# Altium schematic sheet Sheet.SchDoc
size A3
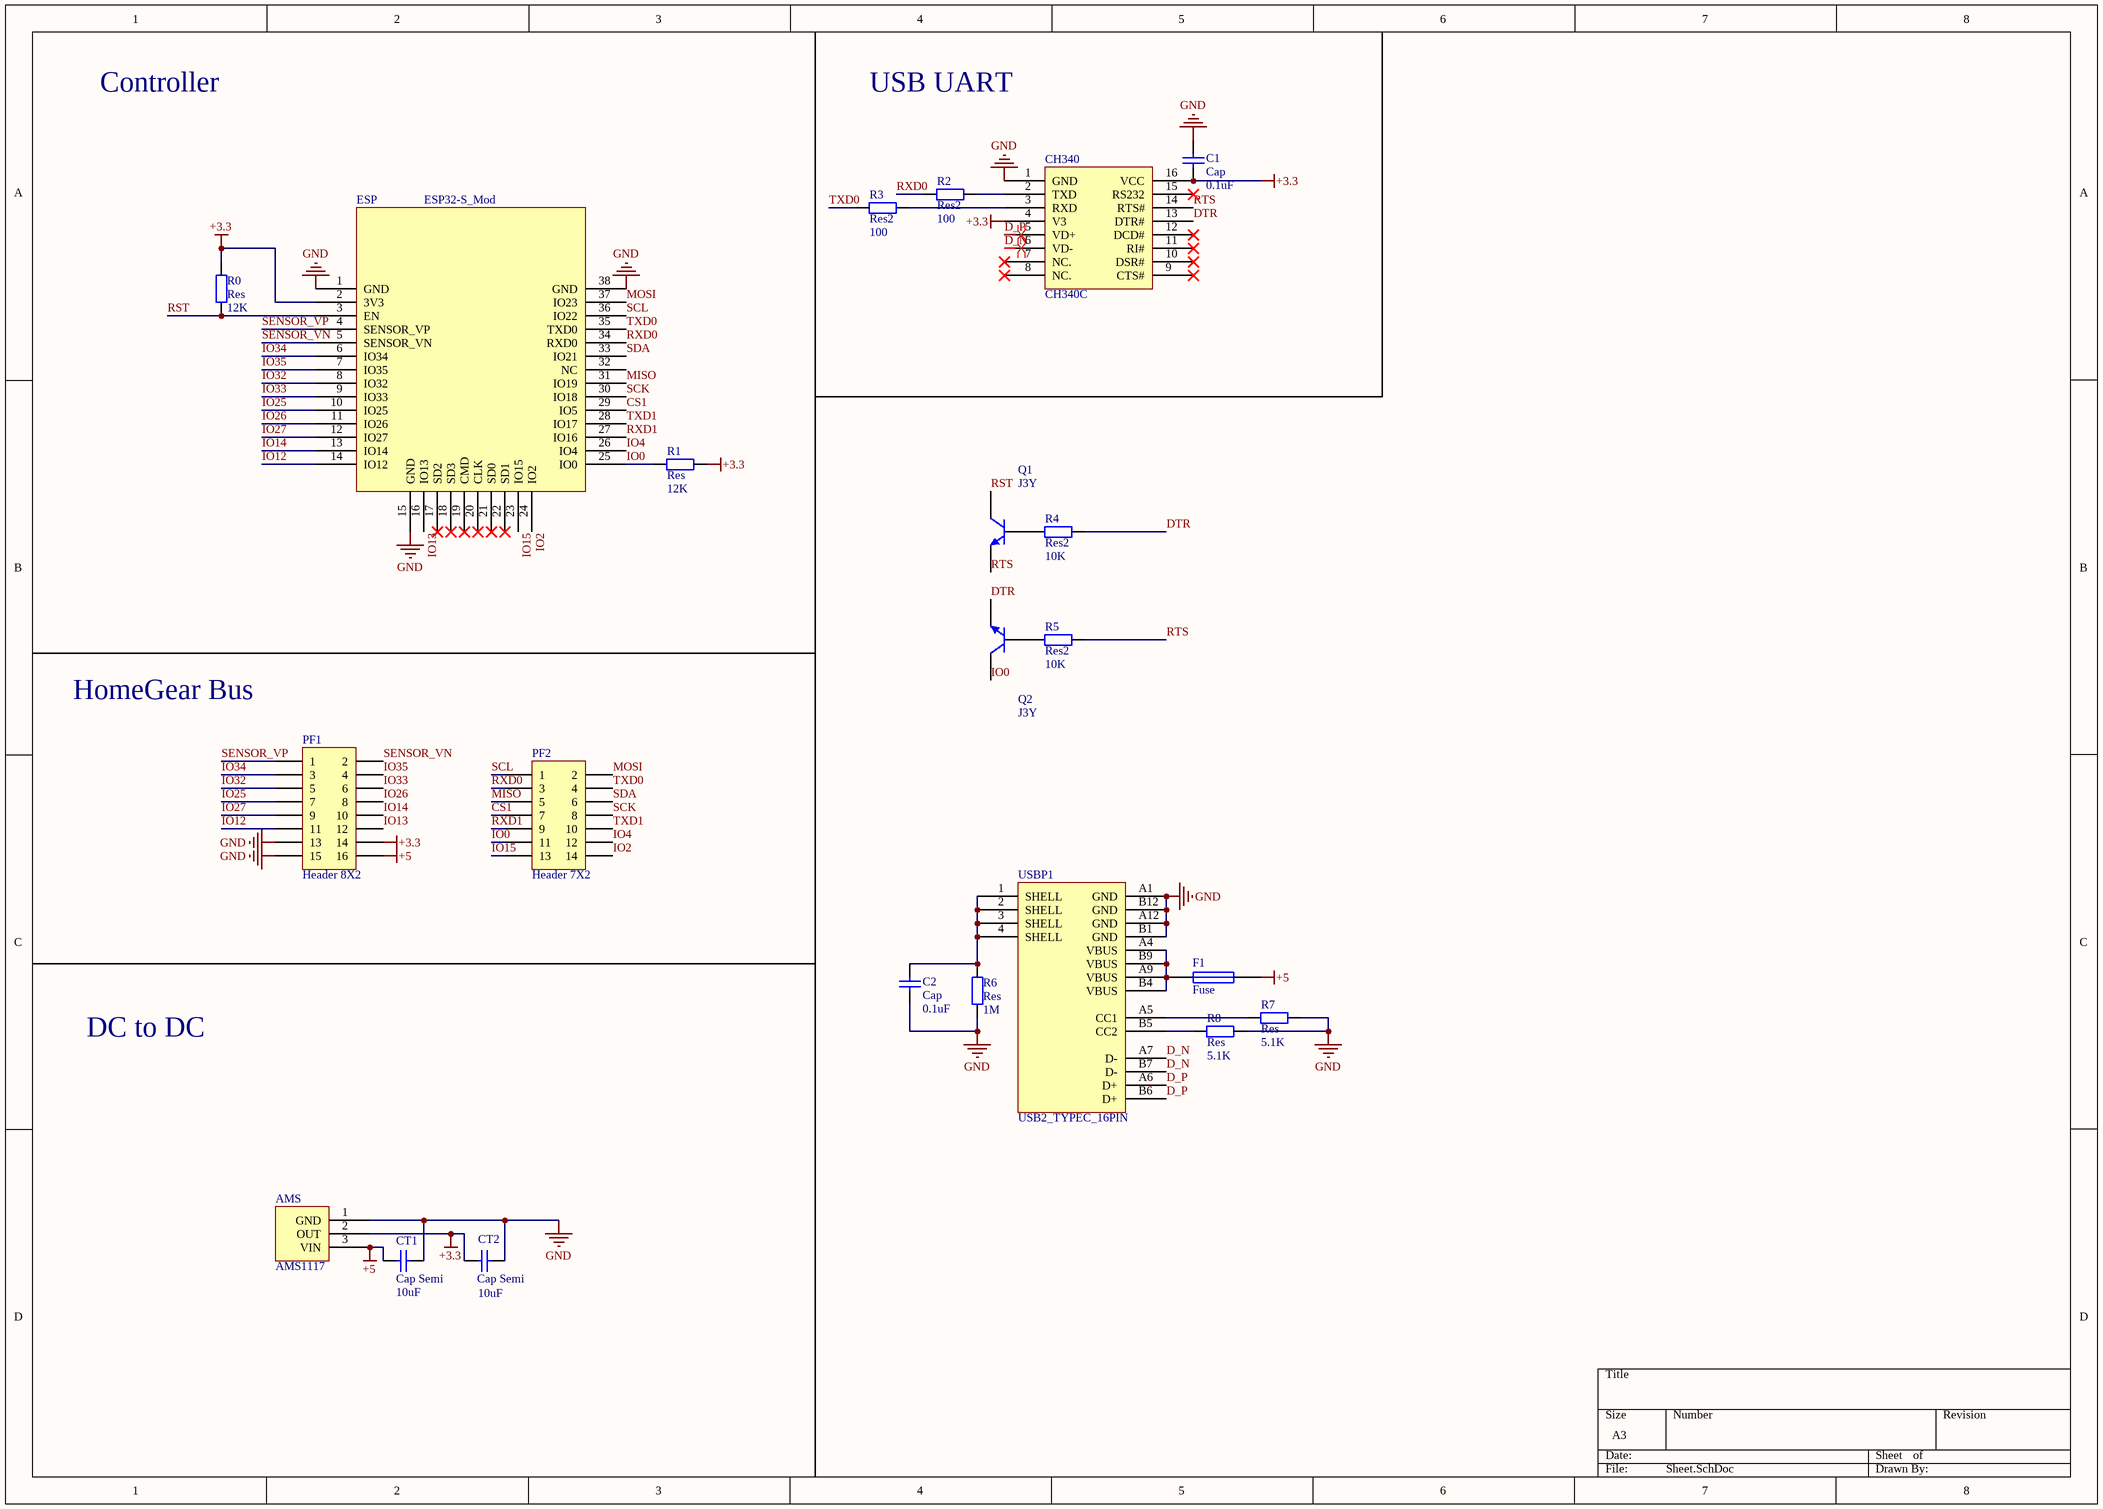
[diagram p0: Sheet.SchDoc]

## Parts
AMS  AMS1117  [SOT-223-2]
C1  Cap  value 0.1uF  [MY0603]
C2  Cap  value 0.1uF  [MY0603]
CH340  CH340C  [SOP16]
CT1  Cap Semi  value 10uF  [My1206]
CT2  Cap Semi  value 10uF  [My1206]
ESP  ESP32-S_Mod  [ESP32-S_Mod]
F1  Fuse  [My1206]
PF1  Header 8X2  [SMD_FEM_HDR8x2_2.0MM]
PF2  Header 7X2  [SMD_FEM_HDR7x2_2.0MM]
Q1  J3Y  [SOT-23B_N]
Q2  J3Y  [SOT-23B_N]
R0  Res  value 12K  [MY0603]
R1  Res  value 12K  [MY0603]
R2  Res2  value 100  [MY0603]
R3  Res2  value 100  [MY0603]
R4  Res2  value 10K  [MY0603]
R5  Res2  value 10K  [MY0603]
R6  Res  value 1M  [MY0603]
R7  Res  value 5.1K  [MY0603]
R8  Res  value 5.1K  [MY0603]
USBP1  USB2_TYPEC_16PIN  [USB-C-SMD16P]

## Nets
+3.3: AMS.2(OUT) C1.1 CH340.4(V3) CH340.16(VCC) CT2.1 ESP.2(3V3) PF1.14 R0.2 R1.1
+5: AMS.3(VIN) CT1.1 F1.2 PF1.16
GND: AMS.1(GND) C1.2 C2.1 CH340.1(GND) CT1.2 CT2.2 ESP.1(GND) ESP.15(GND) ESP.38(GND) PF1.13 PF1.15 R6.1 R7.1 R8.1 USBP1.A1(GND) USBP1.A12(GND) USBP1.B1(GND) USBP1.B12(GND)
CS1: ESP.29(IO5) PF2.7
D_N: CH340.6(VD-) USBP1.A7(D-) USBP1.B7(D-)
D_P: CH340.5(VD+) USBP1.A6(D+) USBP1.B6(D+)
DTR: CH340.13(DTR#) Q2.3(E) R4.2
IO0: ESP.25(IO0) PF2.11 Q2.1(C) R1.2
IO2: ESP.24(IO2) PF2.14
IO4: ESP.26(IO4) PF2.12
IO12: ESP.14(IO12) PF1.11
IO13: ESP.16(IO13) PF1.12
IO14: ESP.13(IO14) PF1.10
IO15: ESP.23(IO15) PF2.13
IO25: ESP.10(IO25) PF1.7
IO26: ESP.11(IO26) PF1.8
IO27: ESP.12(IO27) PF1.9
IO32: ESP.8(IO32) PF1.5
IO33: ESP.9(IO33) PF1.6
IO34: ESP.6(IO34) PF1.3
IO35: ESP.7(IO35) PF1.4
MISO: ESP.31(IO19) PF2.5
MOSI: ESP.37(IO23) PF2.2
RST: ESP.3(EN) Q1.1(C) R0.1
RTS: CH340.14(RTS#) Q1.3(E) R5.2
RXD0: ESP.34(RXD0) PF2.3 R2.1
RXD1: ESP.27(IO16) PF2.9
SCK: ESP.30(IO18) PF2.8
SCL: ESP.36(IO22) PF2.1
SDA: ESP.33(IO21) PF2.6
SENSOR_VN: ESP.5(SENSOR_VN) PF1.2
SENSOR_VP: ESP.4(SENSOR_VP) PF1.1
TXD0: ESP.35(TXD0) PF2.4 R3.1
TXD1: ESP.28(IO17) PF2.10
NetC2_2: C2.2 R6.2 USBP1.1(SHELL) USBP1.2(SHELL) USBP1.3(SHELL) USBP1.4(SHELL)
NetCH340_2: CH340.2(TXD) R2.2
NetCH340_3: CH340.3(RXD) R3.2
NetF1_1: F1.1 USBP1.A4(VBUS) USBP1.A9(VBUS) USBP1.B4(VBUS) USBP1.B9(VBUS)
NetQ1_2: Q1.2(B) R4.1
NetQ2_2: Q2.2(B) R5.1
NetR7_2: R7.2 USBP1.A5(CC1)
NetR8_2: R8.2 USBP1.B5(CC2)

Not connected (* = marked no-connect by the designer): CH340 7(NC.)* 8(NC.)* 9(CTS#)* 10(DSR#)* 11(RI#)* 12(DCD#)* 15(RS232)*; ESP 17(SD2)* 18(SD3)* 19(CMD)* 20(CLK)* 21(SD0)* 22(SD1)* 32(NC)

## Layout directives
differential pair: D_N, D_P

## Notes on the sheet
- Controller
- USB UART
- HomeGear Bus
- DC to DC

## Library data of the parts
C1 C2 = Cap: Capacitor; Published: 8-Jun-2000; LatestRevisionDate: 17-Jul-2002; LatestRevisionNote: Re-released for DXP Platform.; PackageReference: RAD-0.3; Publisher: Altium Limited; PackageDescription: Radial Cap, Thru-Hole; 2 Leads; 0.3 in Pin Spacing
CT1 CT2 = Cap Semi: Capacitor (Semiconductor SIM Model); Published: 8-Jun-2000; LatestRevisionDate: 29-May-2009; LatestRevisionNote: IPC-7351 Footprint Added.; PackageReference: C1206; Publisher: Altium Limited; PackageDescription: Chip Capacitor
F1 = Fuse 1: Published: 8-Jun-2000; LatestRevisionDate: 17-Jul-2002; LatestRevisionNote: Re-released for DXP Platform.; PackageReference: PIN-W2/E2.8; Publisher: Altium Limited; PackageDescription: Thru-Hole; 2 Leads
PF1 = Header 8X2: Header, 8-Pin, Dual row; LatestRevisionDate: 17-Jul-2002; LatestRevisionNote: Re-released for DXP Platform.; Publisher: Altium Limited
PF2 = Header 7X2: Header, 7-Pin, Dual row; LatestRevisionDate: 17-Jul-2002; LatestRevisionNote: Re-released for DXP Platform.; Publisher: Altium Limited
Q1 Q2 = QNPN: NPN Bipolar Transistor; Published: 8-Jun-2000; LatestRevisionDate: 29-May-2009; LatestRevisionNote: IPC-7351 Footprint Added.; PackageVersion: Aug-1999; PackageReference: SOT-23B; Publisher: Altium Limited; PackageDescription: 3-Pin SOT-23 Package 0.95 mm Pitch, 2.4 mm Lead Span
R0-R8 = Res2: Resistor; Published: 8-Jun-2000; LatestRevisionDate: 17-Jul-2002; LatestRevisionNote: Re-released for DXP Platform.; PackageReference: AXIAL-0.4; Publisher: Altium Limited; PackageDescription: Axial Device, Thru-Hole; 2 Leads; 0.4 in Pin Spacing